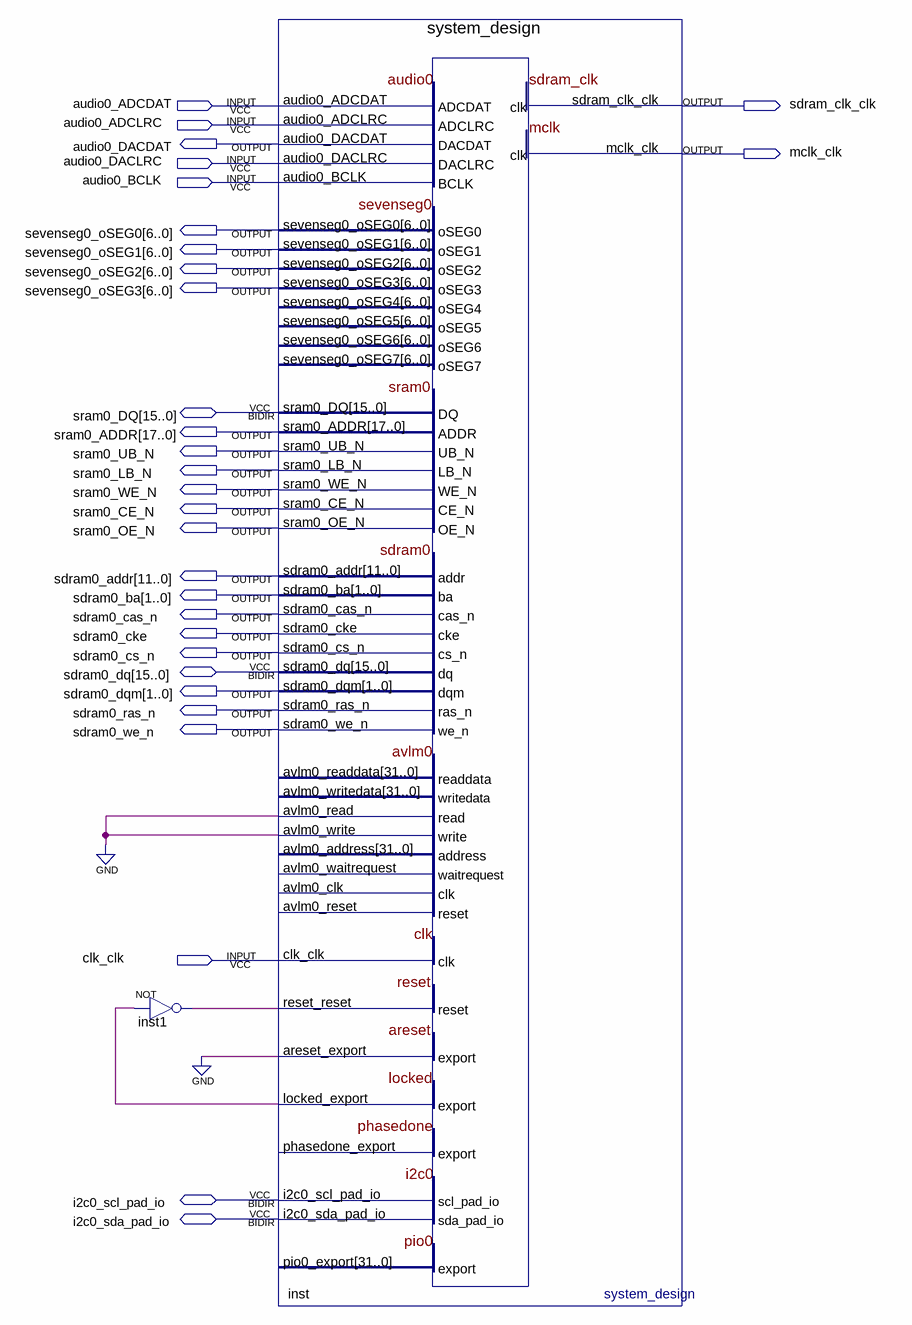
[diagram p0: schematic sheet]
// Quartus schematic puj-ca-de1-audio-pump.bdf as structural Verilog: 2 symbols, 30 pins
module \puj-ca-de1-audio-pump  (
  input  audio0_ADCDAT,
  input  audio0_ADCLRC,
  input  audio0_DACLRC,
  input  audio0_BCLK,
  input  clk_clk,
  inout  [15:0] sram0_DQ,
  inout  [15:0] sdram0_dq,
  inout  i2c0_scl_pad_io,
  inout  i2c0_sda_pad_io,
  output sdram_clk_clk,
  output audio0_DACDAT,
  output mclk_clk,
  output [6:0] sevenseg0_oSEG0,
  output [6:0] sevenseg0_oSEG1,
  output [6:0] sevenseg0_oSEG2,
  output [6:0] sevenseg0_oSEG3,
  output [17:0] sram0_ADDR,
  output sram0_UB_N,
  output sram0_LB_N,
  output sram0_WE_N,
  output sram0_CE_N,
  output sram0_OE_N,
  output [11:0] sdram0_addr,
  output [1:0] sdram0_ba,
  output sdram0_cas_n,
  output sdram0_cke,
  output sdram0_cs_n,
  output [1:0] sdram0_dqm,
  output sdram0_ras_n,
  output sdram0_we_n
);

  wire inst1_out, inst_locked_export;

  not inst1 (inst1_out, inst_locked_export);
  system_design inst (
    .audio0_ADCDAT(audio0_ADCDAT), .audio0_ADCLRC(audio0_ADCLRC), .audio0_DACLRC(audio0_DACLRC),
    .audio0_BCLK(audio0_BCLK), .avlm0_read(1'b0), .avlm0_write(1'b0), .clk_clk(clk_clk),
    .reset_reset(inst1_out), .areset_export(1'b0), .audio0_DACDAT(audio0_DACDAT),
    .sevenseg0_oSEG0(sevenseg0_oSEG0), .sevenseg0_oSEG1(sevenseg0_oSEG1), .sevenseg0_oSEG2(sevenseg0_oSEG2),
    .sevenseg0_oSEG3(sevenseg0_oSEG3), .sram0_ADDR(sram0_ADDR), .sram0_UB_N(sram0_UB_N),
    .sram0_LB_N(sram0_LB_N), .sram0_WE_N(sram0_WE_N), .sram0_CE_N(sram0_CE_N), .sram0_OE_N(sram0_OE_N),
    .sdram0_addr(sdram0_addr), .sdram0_ba(sdram0_ba), .sdram0_cas_n(sdram0_cas_n), .sdram0_cke(sdram0_cke),
    .sdram0_cs_n(sdram0_cs_n), .sdram0_dqm(sdram0_dqm), .sdram0_ras_n(sdram0_ras_n),
    .sdram0_we_n(sdram0_we_n), .sdram_clk_clk(sdram_clk_clk), .mclk_clk(mclk_clk),
    .locked_export(inst_locked_export), .sram0_DQ(sram0_DQ), .sdram0_dq(sdram0_dq),
    .i2c0_scl_pad_io(i2c0_scl_pad_io), .i2c0_sda_pad_io(i2c0_sda_pad_io));  // open: avlm0_writedata, avlm0_address, sevenseg0_oSEG4, sevenseg0_oSEG5, sevenseg0_oSEG6, sevenseg0_oSEG7, avlm0_readdata, avlm0_waitrequest, avlm0_clk, avlm0_reset, phasedone_export, pio0_export
endmodule
